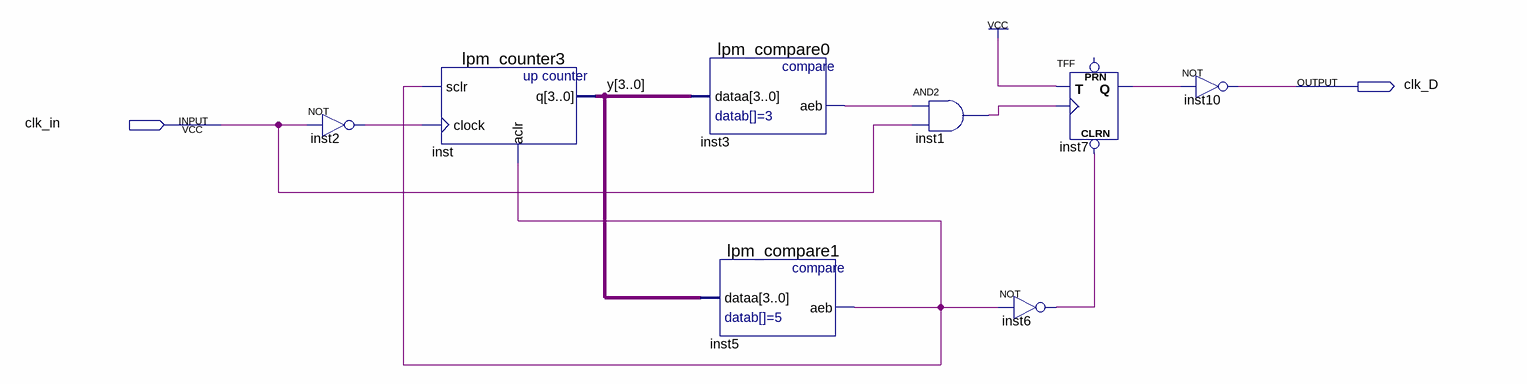
[diagram p0: schematic sheet]
// Quartus schematic Block2.bdf as structural Verilog: 8 symbols, 2 pins
module Block2 (
  input  clk_in,
  output clk_D
);

  wire inst1_out, inst2_out, inst3_aeb, inst5_aeb, inst6_out, inst7_q;
  wire [3:0] y;

  not inst2 (inst2_out, clk_in);
  lpm_counter3 inst (.sclr(inst5_aeb), .clock(inst2_out), .aclr(inst5_aeb), .q(y));
  lpm_compare0 inst3 (.dataa(y), .aeb(inst3_aeb));
  lpm_compare1 inst5 (.dataa(y), .aeb(inst5_aeb));
  and inst1 (inst1_out, inst3_aeb, clk_in);
  not inst6 (inst6_out, inst5_aeb);
  TFF inst7 (.CLRN(inst6_out), .T(1'b1), .CLK(inst1_out), .Q(inst7_q));  // open: PRN
  not inst10 (clk_D, inst7_q);
endmodule
